# EAGLE schematic Main (EAGLE 8.3.2)
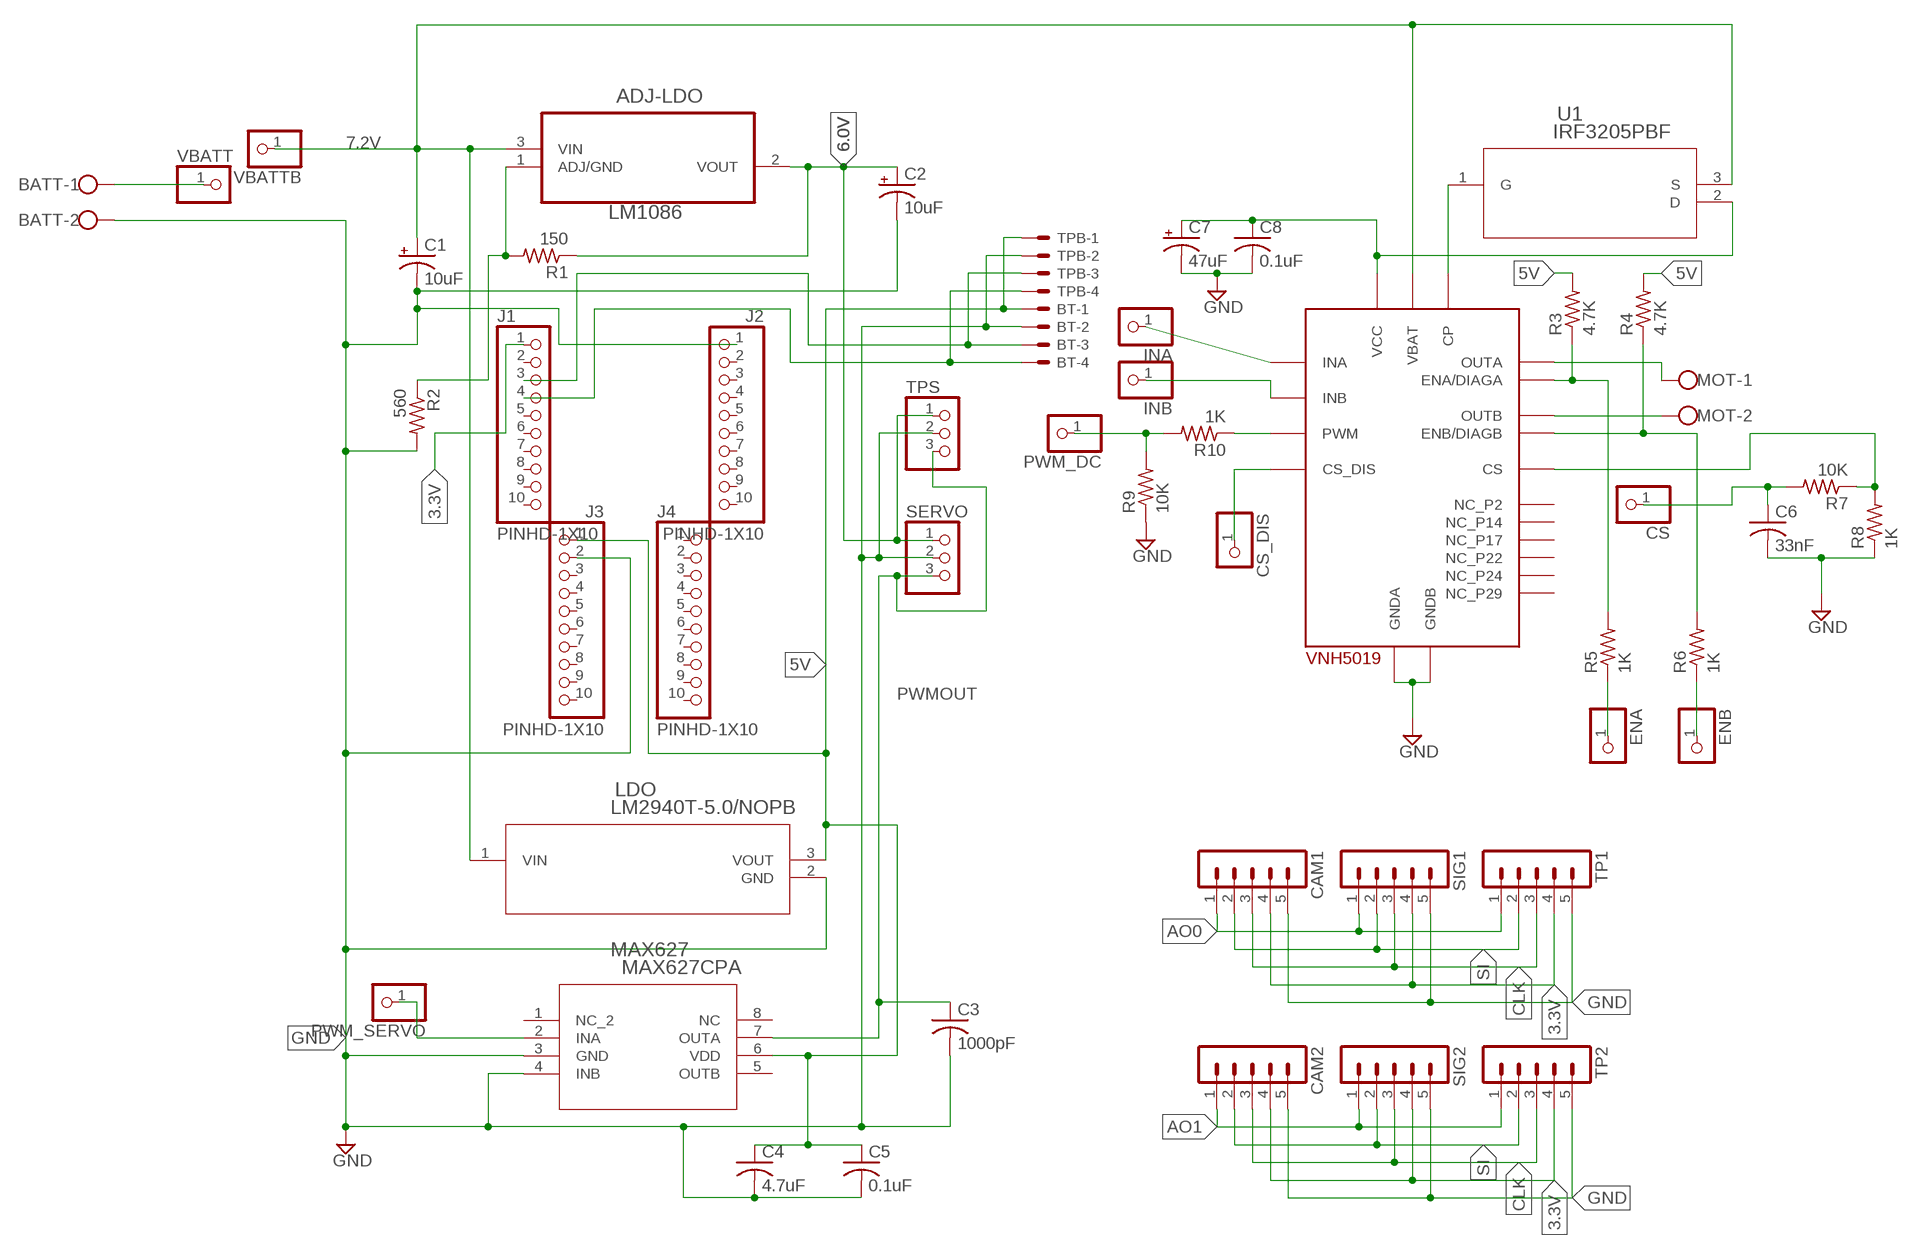
[diagram p0: schematic, sheet 1]

## Parts
ADJ-LDO  LM1086  LM1086CT-ADJ/NOPB  [TO254P470X1016X2222-3P]
BATT  W237-102  [W237-102]
BT  22-23-2041  [22-23-2041]
C1  10uF  CPOL-USE5-10.5  [E5-10,5]
C2  10uF  CPOL-USE5-10.5  [E5-10,5]
C3  1000pF  C-US050-025X075  [C050-025X075]
C4  4.7uF  C-US050-025X075  [C050-025X075]
C5  0.1uF  C-US050-025X075  [C050-025X075]
C6  33nF  C-US050-025X075  [C050-025X075]
C7  47uF  CPOL-USE5-10.5  [E5-10,5]
C8  0.1uF  C-US050-025X075  [C050-025X075]
CAM1  MA05-1  [MA05-1]
CAM2  MA05-1  [MA05-1]
CS  PINHD-1X1  [1X01]
CS_DIS  PINHD-1X1  [1X01]
ENA  PINHD-1X1  [1X01]
ENB  PINHD-1X1  [1X01]
INA  PINHD-1X1  [1X01]
INB  PINHD-1X1  [1X01]
J1  PINHD-1X10  [1X10-BIG]
J2  PINHD-1X10  [1X10-BIG]
J3  PINHD-1X10  [1X10-BIG]
J4  PINHD-1X10  [1X10-BIG]
LDO  LM2940T-5.0/NOPB  [T03B]
MAX627  MAX627CPA  [21-0044B_8]
MOT  W237-102  [W237-102]
PWM_DC  PINHD-1X1  [1X01]
PWM_SERVO  PINHD-1X1  [1X01]
R1  150  R-US_0207/10  [0207/10]
R2  560  R-US_0207/10  [0207/10]
R3  4.7K  R-US_0207/10  [0207/10]
R4  4.7K  R-US_0207/10  [0207/10]
R5  1K  R-US_0207/10  [0207/10]
R6  1K  R-US_0207/10  [0207/10]
R7  10K  R-US_0207/10  [0207/10]
R8  1K  R-US_0207/10  [0207/10]
R9  10K  R-US_0207/10  [0207/10]
R10  1K  R-US_0207/10  [0207/10]
SERVO  PINHD-1X3  [1X03]
SIG1  MA05-1  [MA05-1]
SIG2  MA05-1  [MA05-1]
TP1  MA05-1  [MA05-1]
TP2  MA05-1  [MA05-1]
TPB  22-23-2041  [22-23-2041]
TPS  PINHD-1X3  [1X03]
U1  IRF3205PBF  [TO-220AB]
U$1  VNH5019  [MULTIPOWERSO-30]
VBATT  PINHD-1X1  [1X01]
VBATTB  PINHD-1X1  [1X01]

## Nets
3.3V: CAM1.4 CAM2.4 J1.1 SIG1.4 SIG2.4 TP1.4 TP2.4
5V: BT.1 C4.1 C5.1 J3.1 LDO.3(VOUT) MAX627.6(VDD) R3.2 R4.2 TPB.1
6.0V: ADJ-LDO.2(VOUT) C2.+ R1.1 SERVO.1 TPS.1
7.2V: ADJ-LDO.3(VIN) C1.+ LDO.1(VIN) U1.3(S) U$1.P$12(VBAT) VBATTB.1
AO0: CAM1.1 SIG1.1 TP1.1
AO1: CAM2.1 SIG2.1 TP2.1
CLK: CAM1.3 CAM2.3 SIG1.3 SIG2.3 TP1.3 TP2.3
GND: BATT.2 BT.2 C1.- C2.- C3.2 C4.2 C5.2 C6.2 C7.- C8.2 CAM1.5 CAM2.5 J2.1 J3.2 LDO.2(GND) MAX627.3(GND) MAX627.4(INB) R2.2 R8.1 R9.1 SERVO.2 SIG1.5 SIG2.5 TP1.5 TP2.5 TPB.2 TPS.2 U$1.P$18(GNDB) U$1.P$19(GNDB) U$1.P$20(GNDB) U$1.P$26(GNDA) U$1.P$27(GNDA) U$1.P$28(GNDA)
N$1: BT.3 J1.3 TPB.3
N$2: BT.4 J1.4 TPB.4
N$3: MOT.1 U$1.P$1(OUTA) U$1.P$25(OUTA) U$1.P$30(OUTA) U$1.P$32(OUTA)
N$4: MOT.2 U$1.P$15(OUTB) U$1.P$16(OUTB) U$1.P$21(OUTB) U$1.P$33(OUTB)
N$5: U1.1(G) U$1.P$11(CP)
N$6: PWM_DC.1 R9.2 R10.2
N$7: ADJ-LDO.1(ADJ/GND) R1.2 R2.1
N$8: C7.+ C8.1 U1.2(D) U$1.P$3(VCC) U$1.P$13(VCC) U$1.P$23(VCC) U$1.P$31(VCC)
N$9: INA.1 U$1.P$4(INA)
N$10: INB.1 U$1.P$10(INB)
N$11: R3.1 R5.2 U$1.P$5(ENA/DIAGA)
N$12: R4.1 R6.2 U$1.P$9(ENB/DIAGB)
N$13: ENA.1 R5.1
N$14: ENB.1 R6.1
N$15: C6.1 CS.1 R7.2
N$16: R7.1 R8.2 U$1.P$8(CS)
N$17: R10.1 U$1.P$7(PWM)
N$18: CS_DIS.1 U$1.P$6(CS_DIS)
N$19: MAX627.2(INA) PWM_SERVO.1
PWMOUT: C3.1 MAX627.7(OUTA) SERVO.3 TPS.3
SI: CAM1.2 CAM2.2 SIG1.2 SIG2.2 TP1.2 TP2.2
VBATT: BATT.1 VBATT.1
Unconnected: J1.2 J1.5 J1.6 J1.7 J1.8 J1.9 J1.10 J2.2 J2.3 J2.4 J2.5 J2.6 J2.7 J2.8 J2.9 J2.10 J3.3 J3.4 J3.5 J3.6 J3.7 J3.8 J3.9 J3.10 J4.1 J4.2 J4.3 J4.4 J4.5 J4.6 J4.7 J4.8 J4.9 J4.10 MAX627.1(NC_2) MAX627.5(OUTB) MAX627.8(NC) U$1.P$2(NC_P2) U$1.P$14(NC_P14) U$1.P$17(NC_P17) U$1.P$22(NC_P22) U$1.P$24(NC_P24) U$1.P$29(NC_P29)

## Library data of the parts
ADJ-LDO = LM1086CT-ADJ_NOPB:LM1086CT-ADJ/NOPB: IC, LDO VOLT REG, 5V, 1.5A; AVAILABILITY: Good; DESCRIPTION: Ic, Lm1086ct-Adj/Nopb, 1.5a Posi Tive Low Dropout Reg &lt;Az; MF: Texas Instruments; MP: LM1086CT-ADJ/NOPB; PACKAGE: TO-220 Texas Instruments; PRICE: 1.24 USD
BATT MOT = con-wago-500:W237-102: WAGO SCREW CLAMP; MPN: 237-102; OC_FARNELL: unknown; OC_NEWARK: 70K9898
BT TPB = con-molex:22-23-2041: .100" (2.54mm) Center Header - 4 Pin; MF: MOLEX; MPN: 22-23-2041; OC_FARNELL: 1462920; OC_NEWARK: 38C0355
C1 C2 C7 = rcl:CPOL-US: POLARIZED CAPACITOR, American symbol
C3-C6 C8 = rcl:C-US: CAPACITOR, American symbol
CAM1 CAM2 SIG1 SIG2 TP1 TP2 = con-lstb:MA05-1: PIN HEADER; OC_FARNELL: unknown; OC_NEWARK: unknown
CS CS_DIS ENA ENB INA INB PWM_DC PWM_SERVO VBATT VBATTB = pinhead:PINHD-1X1: PIN HEADER
J1-J4 = adafruit:PINHD-1X10: Pin header 1x10 0.1" spacing With round pins
LDO = lm2940:LM2940T-5.0/NOPB; MANUFACTURER_PART_NUMBER: LM2940T5.0NOPB; VENDOR: Texas Instruments
MAX627 = max627:MAX627CPA; MANUFACTURER_PART_NUMBER: max627cpa; VENDOR: Maxim Integrated Products
R1-R10 = rcl:R-US_: RESISTOR, American symbol
SERVO TPS = adafruit:PINHD-1X3: PIN HEADER
U1 = irf3205:IRF3205PBF; MANUFACTURER_PART_NUMBER: IRF3205PBF; VENDOR: LITEON
U$1 = ece195AB.ucd:VNH5019: VNH5019A-E (STMicroelectronics) Full-bridge Motor Driver http://www.st.com/en/automotive-analog-and-power/vnh5019a-e.html Layout by Dan Fong (Dec 1, 2017)